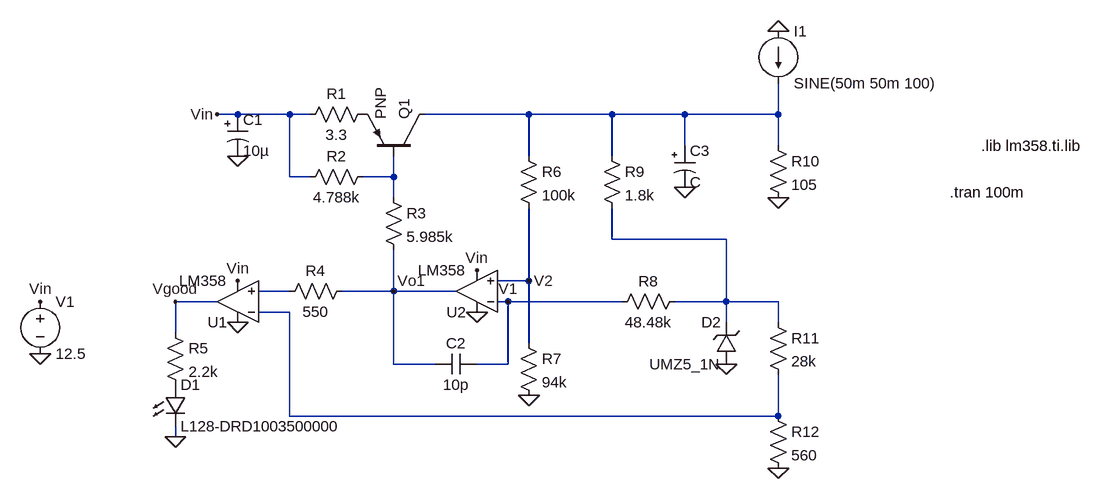
[diagram p0: schematic EEE313FatihLab2.asc]
EEE313FatihLab2.asc, the LTspice schematic file:
Version 4
SHEET 1 1384 680
WIRE 64 48 32 48
WIRE 144 48 64 48
WIRE 176 48 144 48
WIRE 512 48 352 48
WIRE 640 48 512 48
WIRE 752 48 640 48
WIRE 896 48 896 0
WIRE 896 48 752 48
WIRE 752 96 752 48
WIRE 896 96 896 48
WIRE 512 112 512 48
WIRE 640 112 640 48
WIRE 144 144 144 48
WIRE 176 144 144 144
WIRE 304 144 304 112
WIRE 304 144 256 144
WIRE 304 176 304 144
WIRE 640 240 640 192
WIRE 816 240 640 240
WIRE 512 304 512 192
WIRE 512 304 464 304
WIRE 144 320 96 320
WIRE 304 320 304 256
WIRE 304 320 224 320
WIRE 400 320 304 320
WIRE 32 336 -32 336
WIRE 480 336 464 336
WIRE 656 336 480 336
WIRE 816 336 816 240
WIRE 816 336 736 336
WIRE 896 336 816 336
WIRE 144 352 96 352
WIRE 816 368 816 336
WIRE 896 368 896 336
WIRE -32 384 -32 336
WIRE 512 400 512 304
WIRE 304 432 304 320
WIRE 368 432 304 432
WIRE 480 432 480 336
WIRE 480 432 432 432
WIRE 144 512 144 352
WIRE 896 512 896 448
WIRE 896 512 144 512
WIRE -32 544 -32 528
FLAG 64 112 0
FLAG 64 368 0
FLAG 32 48 Vin
FLAG 64 304 Vin
FLAG 432 288 Vin
FLAG 432 352 0
FLAG 512 480 0
FLAG 752 160 0
FLAG 896 176 0
FLAG 896 592 0
FLAG 816 432 0
FLAG -32 336 Vgood
FLAG 304 320 Vo1
FLAG 480 336 V1
FLAG 512 304 V2
FLAG -32 544 0
FLAG -240 416 0
FLAG -240 336 Vin
FLAG 896 -80 0
SYMBOL polcap 48 48 R0
SYMATTR InstName C1
SYMATTR Value 10µ
SYMBOL res 272 32 R90
WINDOW 0 0 56 VBottom 2
WINDOW 3 32 56 VTop 2
SYMATTR InstName R1
SYMATTR Value 3.3
SYMBOL res 272 128 R90
WINDOW 0 0 56 VBottom 2
WINDOW 3 32 56 VTop 2
SYMATTR InstName R2
SYMATTR Value 4.788k
SYMBOL pnp 352 112 M270
SYMATTR InstName Q1
SYMBOL res 288 160 R0
SYMATTR InstName R3
SYMATTR Value 5.985k
SYMBOL res 240 304 R90
WINDOW 0 0 56 VBottom 2
WINDOW 3 32 56 VTop 2
SYMATTR InstName R4
SYMATTR Value 550
SYMBOL OpAmps\\opamp2 64 400 R180
SYMATTR InstName U1
SYMATTR Value LM358
SYMBOL res -48 368 R0
SYMATTR InstName R5
SYMATTR Value 2.2k
SYMBOL LED -48 464 R0
SYMATTR InstName D1
SYMATTR Value L128-DRD1003500000
SYMBOL OpAmps\\opamp2 432 384 R180
SYMATTR InstName U2
SYMATTR Value LM358
SYMBOL res 496 96 R0
SYMATTR InstName R6
SYMATTR Value 100k
SYMBOL res 496 384 R0
SYMATTR InstName R7
SYMATTR Value 94k
SYMBOL cap 432 416 R90
WINDOW 0 0 32 VBottom 2
WINDOW 3 32 32 VTop 2
SYMATTR InstName C2
SYMATTR Value 10p
SYMBOL res 752 320 R90
WINDOW 0 0 56 VBottom 2
WINDOW 3 32 56 VTop 2
SYMATTR InstName R8
SYMATTR Value 48.48k
SYMBOL res 624 96 R0
SYMATTR InstName R9
SYMATTR Value 1.8k
SYMBOL polcap 736 96 R0
SYMATTR InstName C3
SYMBOL res 880 80 R0
SYMATTR InstName R10
SYMATTR Value 105
SYMBOL res 880 352 R0
SYMATTR InstName R11
SYMATTR Value 28k
SYMBOL res 880 496 R0
SYMATTR InstName R12
SYMATTR Value 560
SYMBOL zener 832 432 R180
WINDOW 0 24 64 Left 2
WINDOW 3 24 0 Left 2
SYMATTR InstName D2
SYMATTR Value UMZ5_1N
SYMBOL voltage -240 320 R0
WINDOW 123 0 0 Left 0
WINDOW 39 0 0 Left 0
SYMATTR InstName V1
SYMATTR Value 12.5
SYMBOL current 896 -80 R0
WINDOW 123 0 0 Left 0
WINDOW 39 0 0 Left 0
SYMATTR InstName I1
SYMATTR Value SINE(50m 50m 100)
TEXT 1208 96 Left 2 !.lib lm358.ti.lib
TEXT 1160 168 Left 2 !.tran 100m

The netlist it stands for:
* EEE313FatihLab2.asc
C1 Vin 0 10µ
R1 P001 Vin 3.3
R2 N002 Vin 4.788k
Q1 N001 N002 P001 0 PNP
R3 N002 Vo1 5.985k
R4 Vo1 N004 550
XU1 N004 N005 0 Vin Vgood LM358  ; pins In+ In- V+ V- OUT
R5 Vgood P002 2.2k
D1 P002 0 L128-DRD1003500000
XU2 V2 V1 0 Vin Vo1 LM358  ; pins In+ In- V+ V- OUT
R6 N001 V2 100k
R7 V2 0 94k
C2 V1 Vo1 10p
R8 N003 V1 48.48k
R9 N001 N003 1.8k
C3 N001 0 C
R10 N001 0 105
R11 N003 N005 28k
R12 N005 0 560
D2 0 N003 UMZ5_1N
V1 Vin 0 12.5
I1 0 N001 SINE(50m 50m 100)
.model D D
.lib standard.dio
.model NPN NPN
.model PNP PNP
.lib standard.bjt
.lib lm358.ti.lib
.tran 100m
.backanno
.end